# EAGLE design SPout (EAGLE 9.4.2)
ESKD_DESCRIPTION1: 207|235|224|242|224|32|209|193; ESKD_DESCRIPTION2: 241|245|229|236|224|32|253|235|229|234|242|240|232|247|229|241|234|224|255; ESKD_DESCRIPTION3: 239|240|232|237|246|232|239|232|224|235|252|237|224|255; ESKD_NUMBER: 67|67|83|50|46|51|51|48|48|45|48|221|51; ESKD_NUMBER_SHEET: 49; ESKD_SHEETS: 49
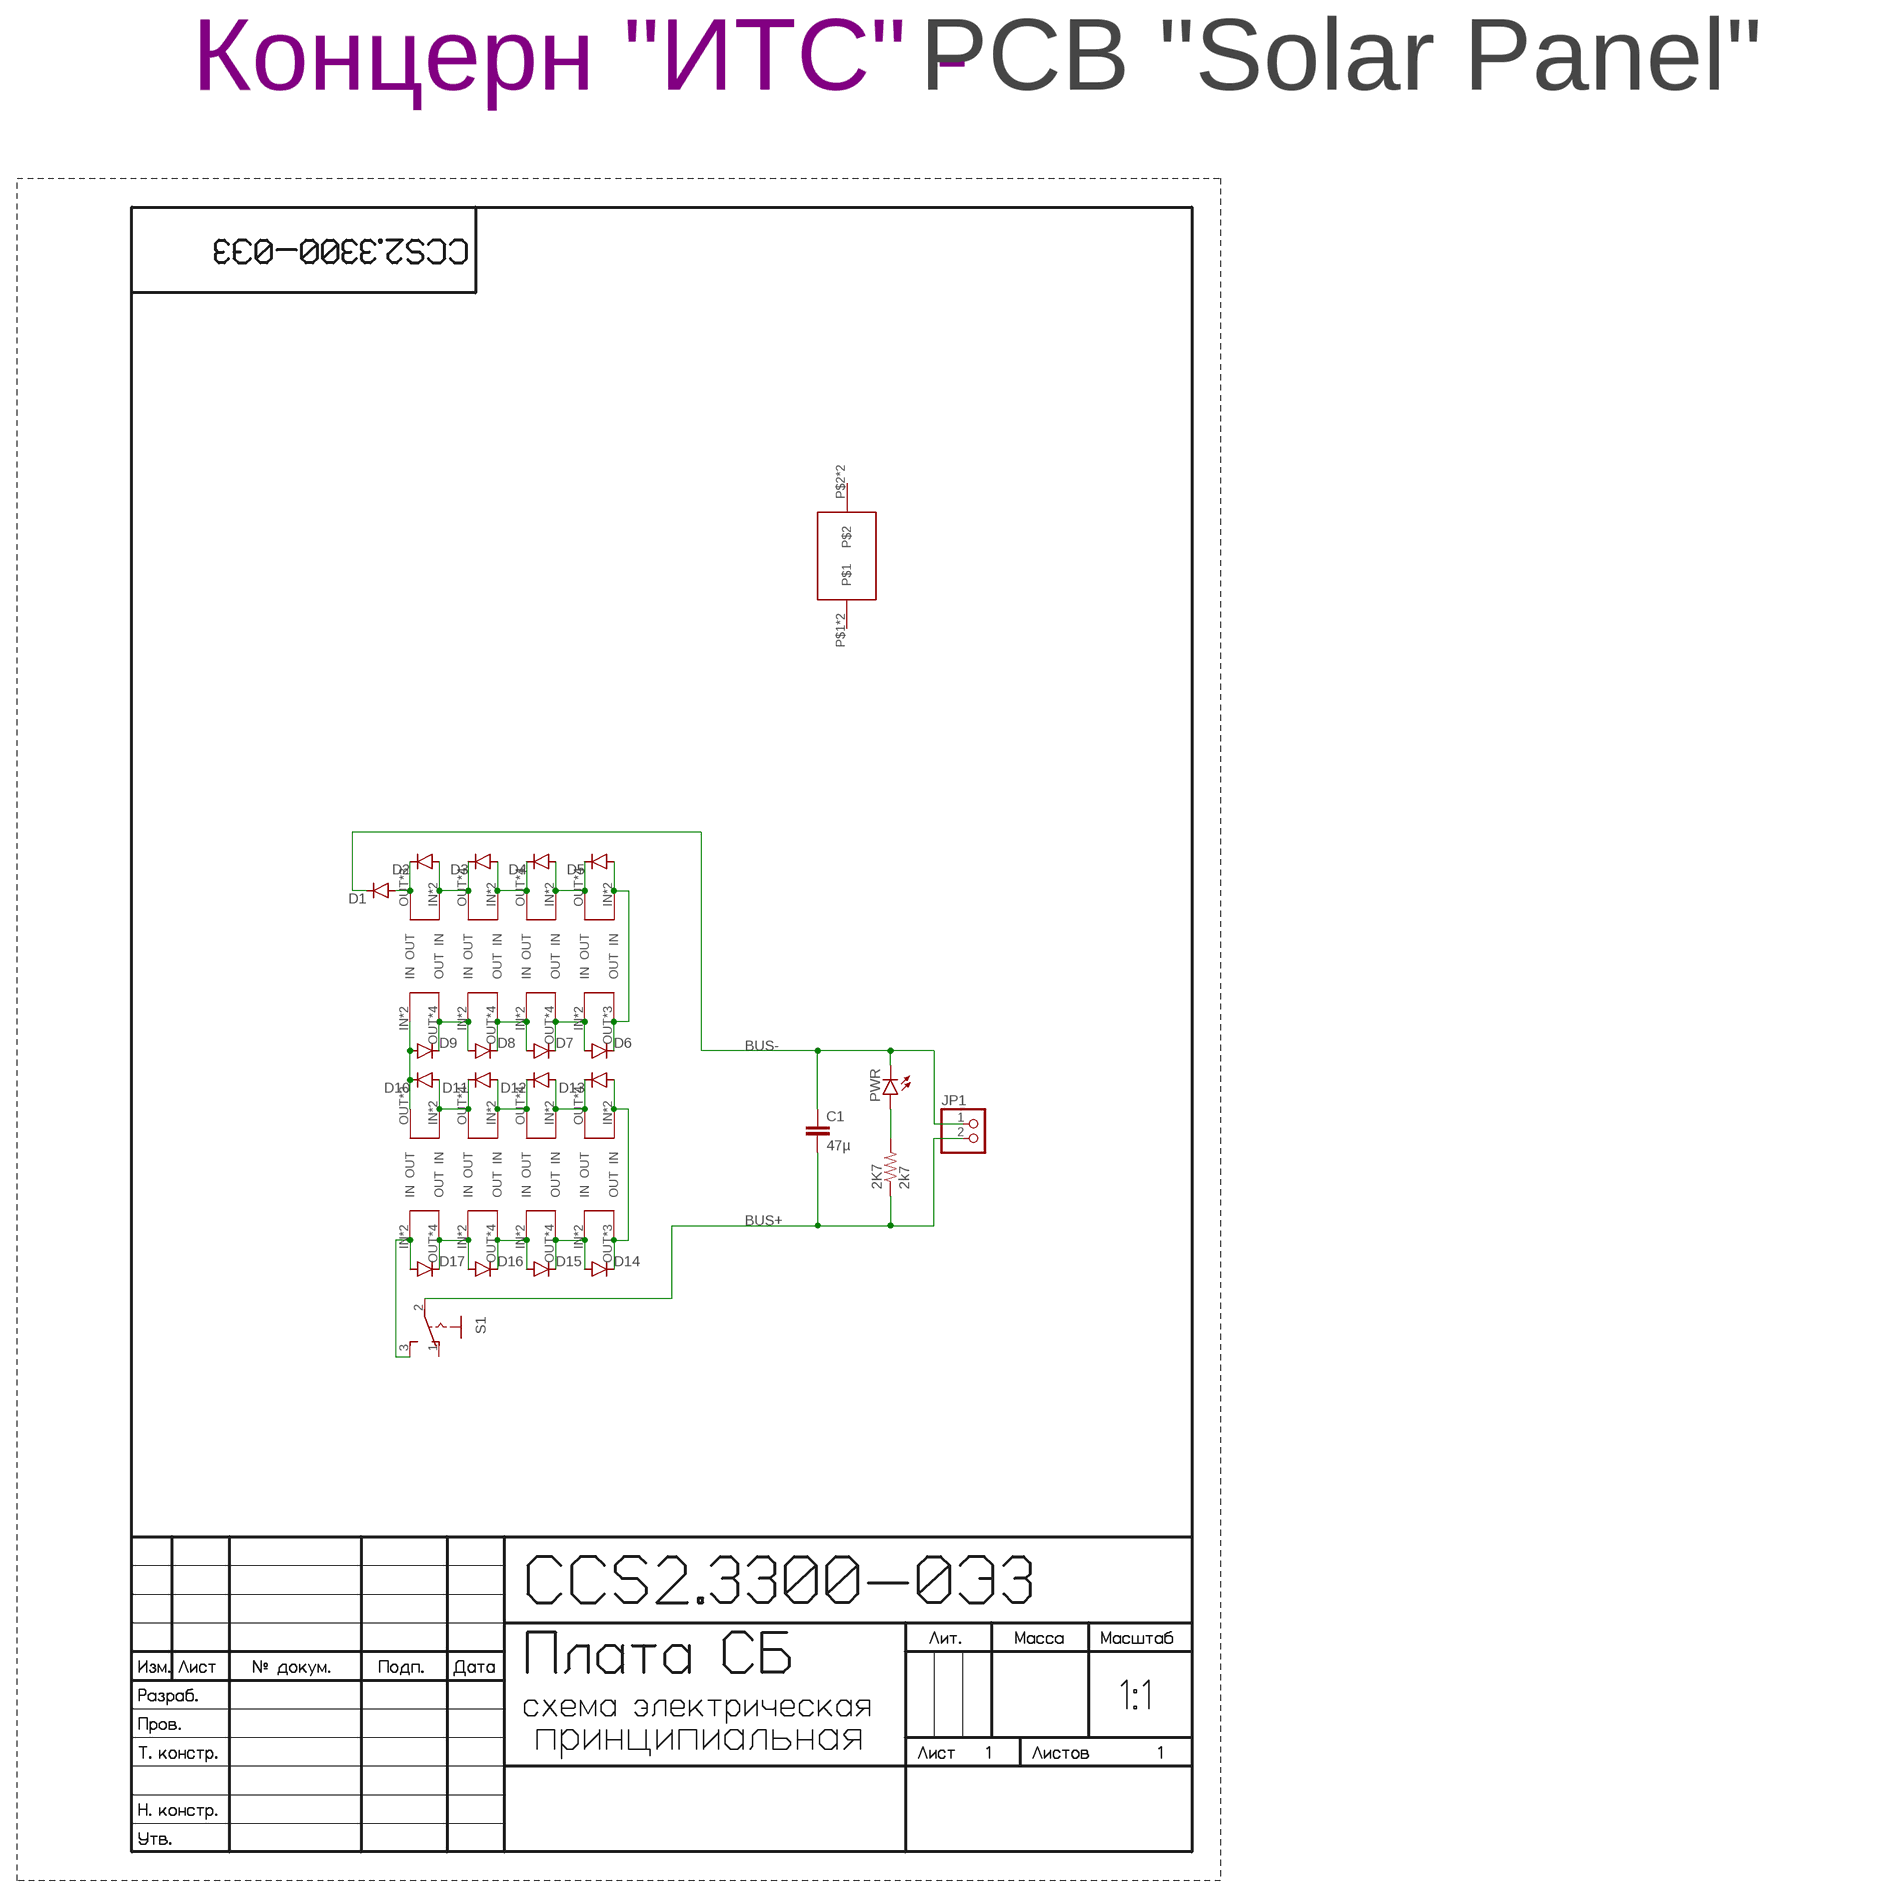
[diagram p0: schematic, sheet 1]

## Parts
2K7  2k7  R-US_R0603  [R0603]
C1  47µ  C-EUC1210  [C1210]
D1  MBR0520LT  [SOD123]
D2  MBR0520LT  [SOD123]
D3  MBR0520LT  [SOD123]
D4  MBR0520LT  [SOD123]
D5  MBR0520LT  [SOD123]
D6  MBR0520LT  [SOD123]
D7  MBR0520LT  [SOD123]
D8  MBR0520LT  [SOD123]
D9  MBR0520LT  [SOD123]
D10  MBR0520LT  [SOD123]
D11  MBR0520LT  [SOD123]
D12  MBR0520LT  [SOD123]
D13  MBR0520LT  [SOD123]
D14  MBR0520LT  [SOD123]
D15  MBR0520LT  [SOD123]
D16  MBR0520LT  [SOD123]
D17  MBR0520LT  [SOD123]
JP1  PINHD-1X2  [1X02]
PWR  LEDCHIPLED_0603  [CHIPLED_0603]
S1  255SB  [255SB]
SOL1  SOLAR-2_0  [SOLAR_0-2]
SOL2  SOLAR-2_0  [SOLAR_0-2]
SOL3  SOLAR-2_0  [SOLAR_0-2]
SOL4  SOLAR-2_1  [SOLAR_1-2]
SOL5  SOLAR-2_0  [SOLAR_0-2]
SOL6  SOLAR-2_0  [SOLAR_0-2]
SOL7  SOLAR-2_0  [SOLAR_0-2]
SOL8  SOLAR-2_1  [SOLAR_1-2]
SOL9  SOLAR-2_0  [SOLAR_0-2]
SOL10  SOLAR-2_0  [SOLAR_0-2]
SOL11  SOLAR-2_0  [SOLAR_0-2]
SOL12  SOLAR-2_1  [SOLAR_1-2]
SOL13  SOLAR-2_0  [SOLAR_0-2]
SOL14  SOLAR-2_0  [SOLAR_0-2]
SOL15  SOLAR-2_0  [SOLAR_0-2]
SOL16  SOLAR-2_1  [SOLAR_1-2]
U$6  GRAFITGRAFIT4_2  [GRAFIT4_2]
U$26  PCB "Solar Panel"  ITS-LOGOPCB-""  [ITS-LOGO]

## Nets
BUS+: 2K7.1 C1.2 JP1.2 S1.2(P)
BUS-: C1.1 D1.C JP1.1 PWR.C
N$1: D16.A D17.C SOL1.OUT SOL1.OUT1(OUT) SOL1.OUT-2(OUT) SOL1.OUT-21(OUT) SOL2.IN SOL2.IN-2(IN)
N$3: D15.A D16.C SOL2.OUT SOL2.OUT1(OUT) SOL2.OUT-2(OUT) SOL2.OUT-21(OUT) SOL3.IN SOL3.IN-2(IN)
N$4: D1.A D2.C SOL16.OUT SOL16.OUT-2(OUT) SOL16.OUT-21(OUT)
N$5: 2K7.2 PWR.A
N$6: D14.A D15.C SOL3.OUT SOL3.OUT1(OUT) SOL3.OUT-2(OUT) SOL3.OUT-21(OUT) SOL4.IN SOL4.IN-2(IN)
N$7: D17.A S1.3(S) SOL1.IN SOL1.IN-2(IN)
N$8: D12.A D13.C SOL5.OUT SOL5.OUT1(OUT) SOL5.OUT-2(OUT) SOL5.OUT-21(OUT) SOL6.IN SOL6.IN-2(IN)
N$9: D11.A D12.C SOL6.OUT SOL6.OUT1(OUT) SOL6.OUT-2(OUT) SOL6.OUT-21(OUT) SOL7.IN SOL7.IN-2(IN)
N$10: D10.A D11.C SOL7.OUT SOL7.OUT1(OUT) SOL7.OUT-2(OUT) SOL7.OUT-21(OUT) SOL8.IN SOL8.IN-2(IN)
N$11: D9.A D10.C SOL8.OUT SOL8.OUT-2(OUT) SOL8.OUT-21(OUT) SOL9.IN SOL9.IN-2(IN)
N$12: D8.A D9.C SOL9.OUT SOL9.OUT1(OUT) SOL9.OUT-2(OUT) SOL9.OUT-21(OUT) SOL10.IN SOL10.IN-2(IN)
N$13: D7.A D8.C SOL10.OUT SOL10.OUT1(OUT) SOL10.OUT-2(OUT) SOL10.OUT-21(OUT) SOL11.IN SOL11.IN-2(IN)
N$14: D6.A D7.C SOL11.OUT SOL11.OUT1(OUT) SOL11.OUT-2(OUT) SOL11.OUT-21(OUT) SOL12.IN SOL12.IN-2(IN)
N$15: D5.A D6.C SOL12.OUT SOL12.OUT-2(OUT) SOL12.OUT-21(OUT) SOL13.IN SOL13.IN-2(IN)
N$16: D4.A D5.C SOL13.OUT SOL13.OUT1(OUT) SOL13.OUT-2(OUT) SOL13.OUT-21(OUT) SOL14.IN SOL14.IN-2(IN)
N$17: D3.A D4.C SOL14.OUT SOL14.OUT1(OUT) SOL14.OUT-2(OUT) SOL14.OUT-21(OUT) SOL15.IN SOL15.IN-2(IN)
N$18: D2.A D3.C SOL15.OUT SOL15.OUT1(OUT) SOL15.OUT-2(OUT) SOL15.OUT-21(OUT) SOL16.IN SOL16.IN-2(IN)
N$24: D13.A D14.C SOL4.OUT SOL4.OUT-2(OUT) SOL4.OUT-21(OUT) SOL5.IN SOL5.IN-2(IN)
Unconnected: S1.1(O) U$6.P$1 U$6.P$2 U$6.P$4 U$6.P$5

## Library data of the parts
2K7 = rcl:R-US_: RESISTOR, American symbol; SPICEPREFIX: R
C1 = rcl:C-EU: CAPACITOR, European symbol; SPICEPREFIX: C
D1-D17 = diode:MBR0520LT: SCHOTTKY BARRIER RECTIFIER Source: http://onsemi.com .. MBR0520LT1-D.pdf
JP1 = pinhead:PINHD-1X2: PIN HEADER
PWR = led:LED: LED OSRAM: - CHIPLED LG R971, LG N971, LY N971, LG Q971, LY Q971, LO R971, LY R971 LH N974, LH R974 LS Q976, LO Q976, LY Q976 LO Q996 - Hyper CHIPLED LW Q18S LB Q993, LB Q99A, LB R99A - SideLED LS A670, LO A670, LY A670, LG A670, LP A670 LB A673, LV A673, LT A673, LW A673 LH A674 LY A675 LS A676, LA A676, LO A676, LY A676, LW A676 LS A679, LY A679, LG A679 - Hyper Micro SIDELED® LS Y876, LA Y876, LO Y876, LY Y876 LT Y87S - SmartLED LW L88C, LW L88S LB L89C, LB L89S, LG L890 LS L89K, LO L89K, LY L89K LS L896, LA L896, LO L896, LY L896 - TOPLED LS T670, LO T670, LY T670, LG T670, LP T670 LSG T670, LSP T670, LSY T670, LOP T670, LYG T670 LG T671, LOG T671, LSG T671 LB T673, LV T673, LT T673, LW T673 LH T674 LS T676, LA T676, LO T676, LY T676, LB T676, LH T676, LSB T676, LW T676 LB T67C, LV T67C, LT T67C, LS T67K, LO T67K, LY T67K, LW E67C LS E67B, LA E67B, LO E67B, LY E67B, LB E67C, LV E67C, LT E67C LW T67C LS T679, LY T679, LG T679 LS T770, LO T770, LY T770, LG T770, LP T770 LB T773, LV T773, LT T773, LW T773 LH T774 LS E675, LA E675, LY E675, LS T675 LS T776, LA T776, LO T776, LY T776, LB T776 LHGB T686 LT T68C, LB T68C - Hyper Mini TOPLED® LB M676 - Mini TOPLED Santana® LG M470 LS M47K, LO M47K, LY M47K Source: http://www.osram.convergy.de LUXEON: - LUMILED® LXK2-PW12-R00, LXK2-PW12-S00, LXK2-PW14-U00, LXK2-PW14-V00 LXK2-PM12-R00, LXK2-PM12-S00, LXK2-PM14-U00 LXK2-PE12-Q00, LXK2-PE12-R00, LXK2-PE12-S00, LXK2-PE14-T00, LXK2-PE14-U00 LXK2-PB12-K00, LXK2-PB12-L00, LXK2-PB12-M00, LXK2-PB14-N00, LXK2-PB14-P00, LXK2-PB14-Q00 LXK2-PR12-L00, LXK2-PR12-M00, LXK2-PR14-Q00, LXK2-PR14-R00 LXK2-PD12-Q00, LXK2-PD12-R00, LXK2-PD12-S00 LXK2-PH12-R00, LXK2-PH12-S00 LXK2-PL12-P00, LXK2-PL12-Q00, LXK2-PL12-R00 Source: www.luxeon.com KINGBRIGHT: KA-3528ASYC Source: www.kingbright.com
S1 = CanCubeSat:255SB: SLIDING SWITCH Distributor Buerklin, 11G810
SOL1-SOL16 = CanCubeSat:SOLAR-2
U$6 = CanCubeSat:GRAFIT
U$26 = CanCubeSat:ITS-LOGO

## Board
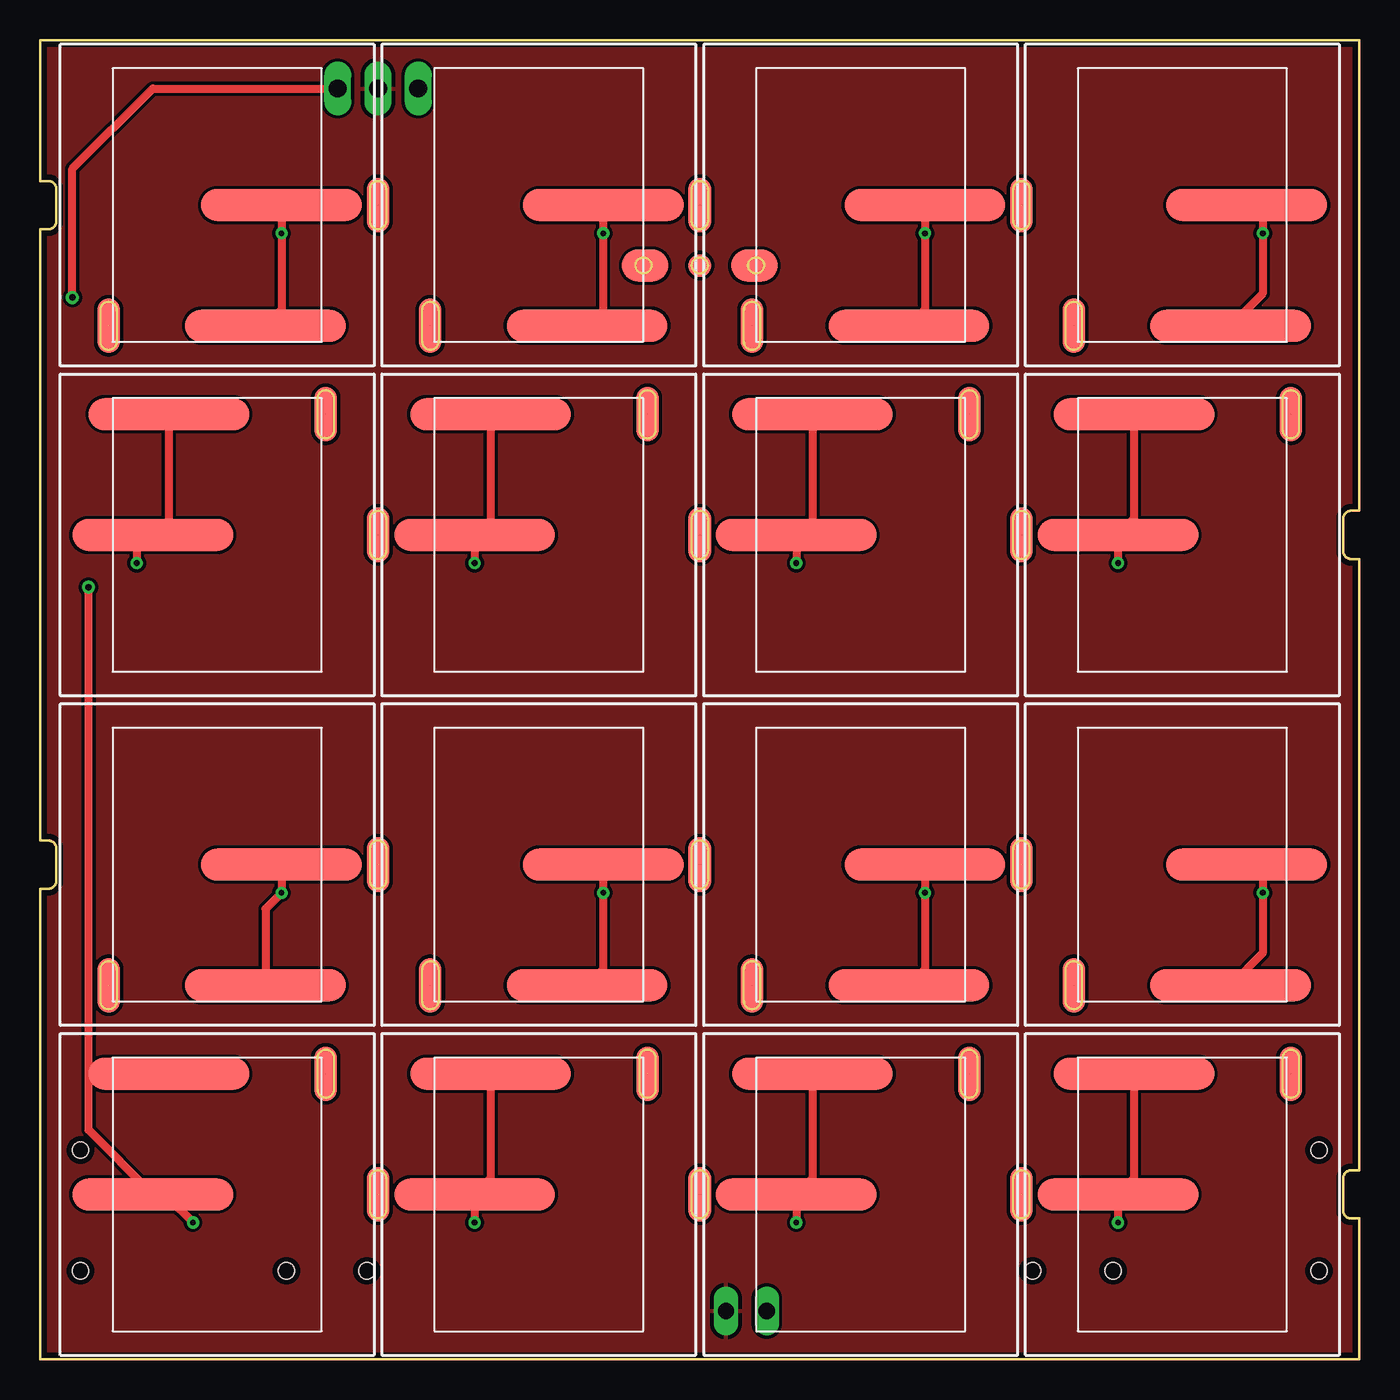
[diagram p1: board, top side]
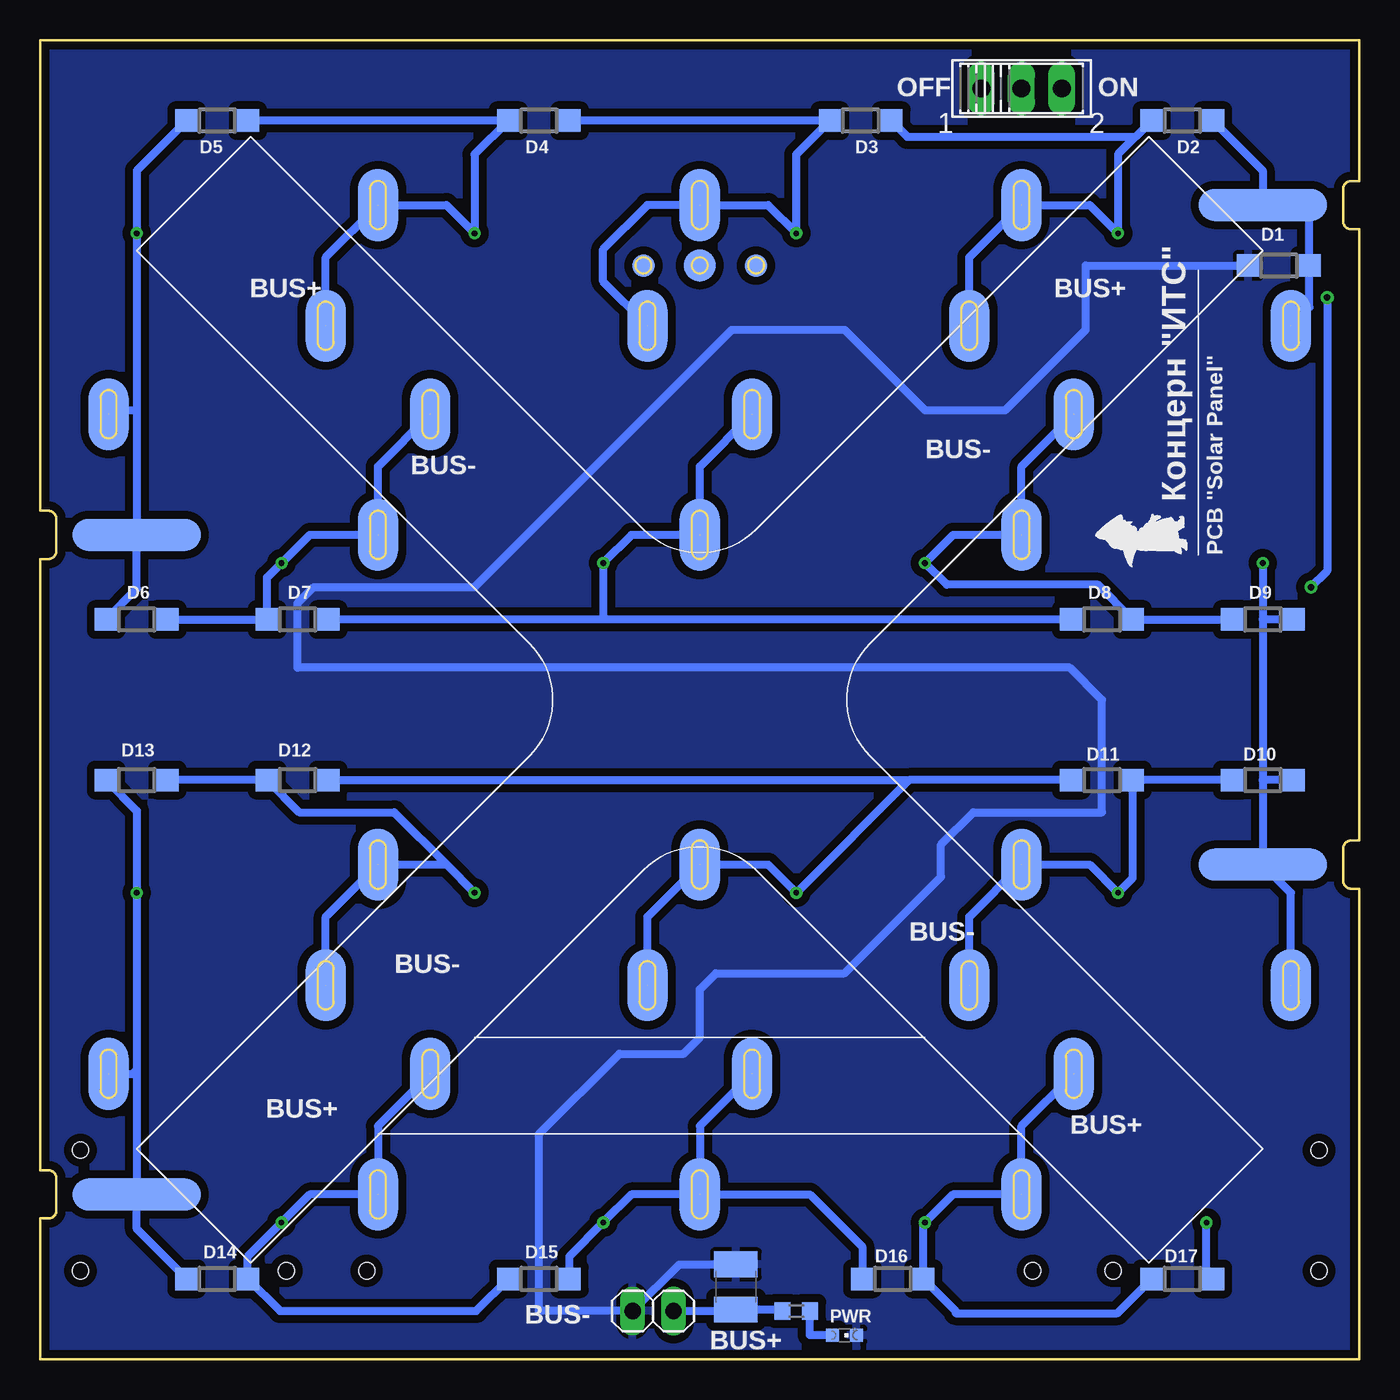
[diagram p2: board, bottom side, seen from below]

Size 82 x 82 mm. Coordinates in mm from the lower left corner, seen from the top.
Outline: 0,0 82,0 82,8.75 81.5,8.75 arc-90 81,9.25 81,11.25 arc-90 81.5,11.75 82,11.75 82,49.75 81.5,49.75 arc-90 81,50.25 81,52.25 arc-90 81.5,52.75 82,52.75 82,82 0,82 0,73.25 0.5,73.25 arc-90 1,72.75 1,70.75 arc-90 0.5,70.25 0,70.25 0,32.25 0.5,32.25 arc-90 1,31.75 1,29.75 arc-90 0.5,29.25 0,29.25 0,0
Copper layers (1*16): Top 0.035mm / dielectric 1.5mm / Bottom 0.035mm
Design rules "default *": minimum track width 0.5mm, minimum drill 0.35mm, track to track 0.2mm, track to pad 0.2mm, pad to pad 0.2mm, via to via 0.2mm, smd to smd 0.2mm, copper to edge 0.35mm, drill to drill 6mil, minimum pad ring 10mil, minimum via ring 8mil, stop-mask expansion 2mil, vias tented up to drill 0mil, thermal gap 10mil
Holes 1 mm at 79.5,5.5 79.5,13 66.7,5.5 61.7,5.5 20.3,5.5 15.3,5.5 2.5,5.5 2.5,13

### Footprints (pad centres in the part's own frame; a part is rotated, then mirrored left to right if it is on the bottom)
R0603 = smd 1 x 1.1: 1 -0.85,0; 2 0.85,0
C1210 = smd 1.6 x 2.7: 1 -1.4,0; 2 1.4,0
SOD123 = smd 1.4 x 1.4: A 1.9,0; C -1.9,0
1X02 = drill 1.016 long: 1 -1.27,0; 2 1.27,0
CHIPLED_0603 = smd 0.8 x 0.8: A 0,-0.75; C 0,0.75
255SB = drill 1.118 long: 1 -2.5,0; 2 0,0; 3 2.5,0
SOLAR_0-2 = smd 2 x 10: IN 0,-4; IN-2 -7.5,-3 | smd 4.5 x 2.5 bottom: OUT 0,10; OUT-2 -7.5,6.75 | smd 3.4 x 1.4: OUT1 0,10; OUT-21 -7.5,6.75
SOLAR_1-2 = smd 2 x 10: IN 0,-4; IN-2 -7.5,-3 | smd 2 x 8 bottom: OUT 0,5 | smd 4.5 x 2.5 bottom: OUT-2 -7.5,6.75 | smd 3.4 x 1.4: OUT-21 -7.5,6.75
GRAFIT4_2 = smd 2 x 2 bottom: OUT 0,0 | smd 2 x 2.9: P$1 0,3.4; P$2 0,-3.4 | smd 1.4 x 1.4: P$3 0,0 | smd 1.4 x 1.4 bottom: P$4 0,3.5; P$5 0,-3.5

### Placement (x,y rotation side)
2K7  35,3 0 bottom
C1  38.75,4.5 270 bottom
D1  5,68 0 bottom
D2  11,77 180 bottom
D3  31,77 180 bottom
D4  51,77 180 bottom
D5  71,77 180 bottom
D6  76,46 0 bottom
D7  66,46 0 bottom
D8  16,46 0 bottom
D9  6,46 0 bottom
D10  6,36 180 bottom
D11  16,36 180 bottom
D12  66,36 180 bottom
D13  76,36 180 bottom
D14  71,5 0 bottom
D15  51,5 0 bottom
D16  29,5 0 bottom
D17  11,5 0 bottom
JP1  43.9,3 0 bottom
PWR  32,1.5 270 bottom
S1  21,79 0 bottom
SOL1  11,10.25 270 top
SOL2  31,10.25 270 top
SOL3  51,10.25 270 top
SOL4  71,10.25 270 top
SOL5  71,30.75 90 top
SOL6  51,30.75 90 top
SOL7  31,30.75 90 top
SOL8  11,30.75 90 top
SOL9  11,51.25 270 top
SOL10  31,51.25 270 top
SOL11  51,51.25 270 top
SOL12  71,51.25 270 top
SOL13  71,71.75 90 top
SOL14  51,71.75 90 top
SOL15  31,71.75 90 top
SOL16  11,71.75 90 top
U$6  41,68 90 top
U$26  10,50 90 bottom

### Tracks (layer width: path | path; a pad name or v marks a point on that pad's centre or on a via)
BUS+
  Bottom 0.5: JP1.2 38.85,3 C1.2 35.95,3.1 2K7.1
  pour Top: 82,0 82,82 0,82 0,0
BUS-
  Bottom 0.5: D1.C 17,68 17,64 22,59 27,59 32,64 39,64 55,48 65,48 66,47 66,43 18,43 16,41 16,34 24,34 26,32 26,30 32,24 40,24 41,23 41,20 42,19 46,19 51,14 51,3 JP1.1 | 45,3 JP1.1 | JP1.1 42.27,5.9 C1.1
  pour Bottom (isolate 0.5): 0.15,0.3 81.7,0.3 81.7,82.3 0.15,82.3
N$1  (via drill 0.35)  (2 unrouted)
  Top 0.5: v27,8.5 SOL2.IN 28,11.25 SOL2.IN-2
  Bottom 0.5: D17.C 15.03,2.87 25.1,2.87 25.1,3 D16.A 27.1,8.4 v27,8.5 25.25,10.25 SOL1.OUT1 21,14.5 SOL1.OUT-21
N$3  (via drill 0.35)  (2 unrouted)
  Top 0.5: v47,8.5 SOL3.IN 48,11.25 SOL3.IN-2
  Bottom 0.5: D15.A 49.1,6.4 v47,8.5 45.25,10.25 SOL2.OUT1 | D16.C 30.9,7 34.15,10.25 SOL2.OUT1 | SOL2.OUT1 41,14.5 SOL2.OUT-21
N$4  (1 unrouted)
  Bottom 0.5: D2.C 6,73.9 SOL16.OUT 3.1,71.75 D1.A 3.1,65.4 SOL16.OUT-21
N$5
  Bottom 0.5: PWR.A 34.15,1.5 2K7.2
N$6  (via drill 0.35)  (2 unrouted)
  Top 0.5: v67,8.5 SOL4.IN 68,11.25 SOL4.IN-2
  Bottom 0.5: D15.C 54.9,3 67.1,3 D14.A 69.1,6.4 v67,8.5 65.25,10.25 SOL3.OUT1 61,14.5 SOL3.OUT-21
N$7  (via drill 0.35, 0.4)
  Top 0.5: v9.5,8.5 8,10 7,10 SOL1.IN 3,14.25 3,18 | 3,18 v3,48 | v2,66 2,74 7,79 S1.3 | SOL1.IN-2 3.25,17.75 3,18
  Bottom 0.5: D17.A 9.5,5.4 v9.5,8.5 | v2,66 2,49 v3,48
N$8  (via drill 0.35)  (2 unrouted)
  Top 0.5: SOL6.IN v55,29 55,24.25 SOL6.IN-2
  Bottom 0.5: 56.75,30.75 SOL5.OUT1 64.25,27.5 SOL5.OUT-21 | 56.75,30.75 v55,29 | 56.75,30.75 60,34 65.9,34 D12.A D13.C
N$9  (via drill 0.35)  (2 unrouted)
  Top 0.5: SOL7.IN v35,29 35,24.25 SOL7.IN-2
  Bottom 0.5: D11.A 28,36 | 28,36 v35,29 36.75,30.75 SOL6.OUT1 44.25,27.5 SOL6.OUT-21 | D12.C 28,36
N$10  (via drill 0.35)  (2 unrouted)
  Top 0.5: SOL8.IN v15,29 14,28 SOL8.IN-2
  Bottom 0.5: D10.A D11.C 14.1,29.9 v15,29 16.75,30.75 SOL7.OUT1 24.25,27.5 SOL7.OUT-21
N$11  (via drill 0.35)  (1 unrouted)
  Top 0.5: v6,49.5 6,51 7,51 | 7,51 SOL9.IN | SOL9.IN-2 8,52 7,51
  Bottom 0.5: v6,49.5 6,46 | 6,46 6,36 | 6,36 SOL8.OUT 4.25,29 SOL8.OUT-21 | D9.A 6,46 | D10.C 6,36
N$12  (via drill 0.35)  (2 unrouted)
  Top 0.5: SOL10.IN 27,51 | 27,51 v27,49.5 | SOL10.IN-2 28,52 27,51
  Bottom 0.5: D9.C D8.A 16.25,48.15 25.65,48.15 v27,49.5 25.25,51.25 SOL9.OUT1 21,55.5 SOL9.OUT-21
N$13  (via drill 0.35)  (2 unrouted)
  Top 0.5: SOL11.IN 47,51 | 47,51 v47,49.5 | SOL11.IN-2 48,52 47,51
  Bottom 0.5: D8.C 47,46 | 47,46 D7.A | 47,46 v47,49.5 45.25,51.25 SOL10.OUT1 41,55.5 SOL10.OUT-21
N$14  (via drill 0.35)  (2 unrouted)
  Top 0.5: v67,49.5 SOL12.IN 68,52.25 SOL12.IN-2
  Bottom 0.5: D6.A D7.C 67.9,48.6 v67,49.5 65.25,51.25 SOL11.OUT1 61,55.5 SOL11.OUT-21
N$15  (via drill 0.35)  (1 unrouted)
  Top 0.5: SOL13.IN 75,71.5 76,71.5 v76,70 76,66.25 SOL13.IN-2
  Bottom 0.5: 76,59 v76,70 76,73.9 D5.A | 76,59 SOL12.OUT 76,47.9 D6.C | SOL12.OUT-21 77.5,59 76,59
N$16  (via drill 0.35)  (2 unrouted)
  Top 0.5: SOL14.IN v55,70 55,65.25 SOL14.IN-2
  Bottom 0.5: D5.C D4.A 55,74.9 v55,70 56.75,71.75 SOL13.OUT1 64.25,68.5 SOL13.OUT-21
N$17  (via drill 0.35)  (2 unrouted)
  Top 0.5: SOL15.IN v35,70 35,65 34,64 33,64 33.25,64.25 SOL15.IN-2
  Bottom 0.5: D4.C D3.A 35,74.9 v35,70 36.75,71.75 SOL14.OUT1 44.25,71.75 47,69 47,67 SOL14.OUT-21
N$18  (via drill 0.35)  (2 unrouted)
  Top 0.5: SOL16.IN v15,70 15,65.25 SOL16.IN-2
  Bottom 0.5: D3.C 28.1,76 13.9,76 D2.A 15,74.9 v15,70 16.75,71.75 SOL15.OUT1 24.25,68.5 SOL15.OUT-21
N$24  (via drill 0.35)  (1 unrouted)
  Top 0.5: SOL5.IN 75,30.5 76,30.5 v76,29 76,25.25 SOL5.IN-2
  Bottom 0.5: 76,18 v76,29 76,34.1 D13.A | 76,18 SOL4.OUT 76,8.1 D14.C | SOL4.OUT-21 76.25,17.75 76,18

### Text on the board
bNames: ON | OFF | BUS+ | BUS+ | BUS- | BUS- | BUS- | BUS- | BUS+ | BUS+ | BUS- | BUS+